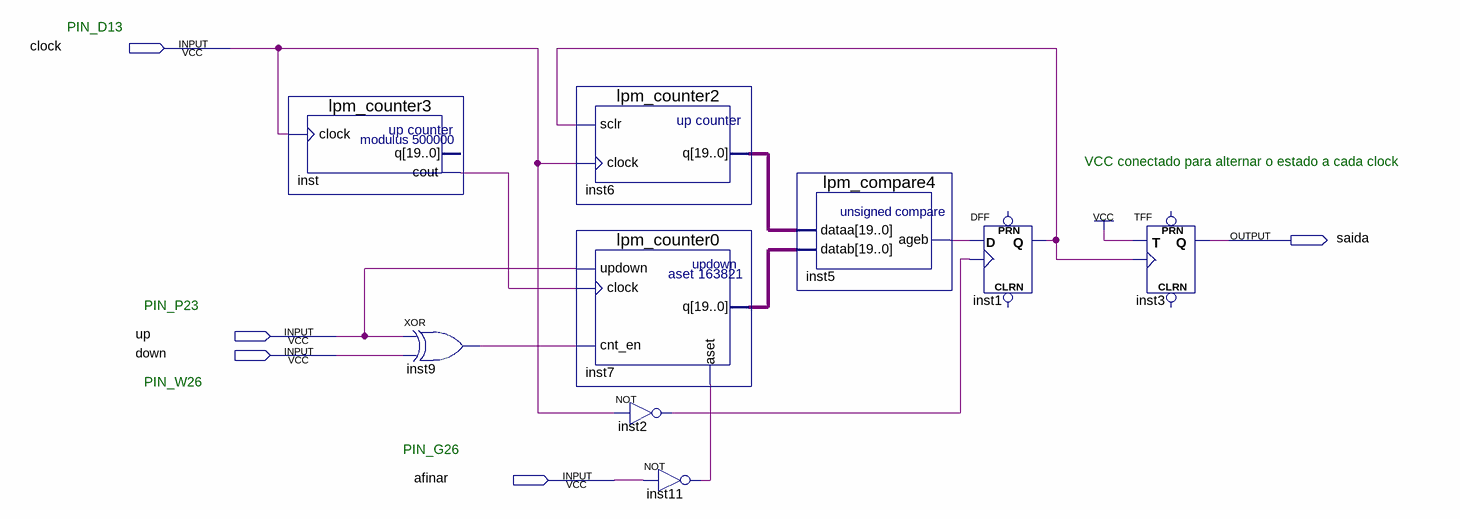
[diagram p0: schematic sheet]
// Quartus schematic oscilador.bdf as structural Verilog: 9 symbols, 5 pins
module oscilador (
  input  clock,
  input  up,
  input  down,
  input  afinar,
  output saida
);

  wire inst1_q, inst2_out, inst5_ageb, inst9_out, inst11_out, inst_cout;
  wire [19:0] inst6_q, inst7_q;

  lpm_counter3 inst (.clock(clock), .cout(inst_cout));  // open: q
  xor inst9 (inst9_out, up, down);
  lpm_counter2 inst6 (.sclr(inst1_q), .clock(clock), .q(inst6_q));
  lpm_counter0 inst7 (.updown(up), .clock(inst_cout), .cnt_en(inst9_out), .aset(inst11_out), .q(inst7_q));
  not inst2 (inst2_out, clock);
  not inst11 (inst11_out, afinar);
  lpm_compare4 inst5 (.dataa(inst6_q), .datab(inst7_q), .ageb(inst5_ageb));
  DFF inst1 (.CLK(inst2_out), .D(inst5_ageb), .Q(inst1_q));  // open: CLRN, PRN
  TFF inst3 (.T(1'b1), .CLK(inst1_q), .Q(saida));  // open: PRN, CLRN

  // Notes on the sheet:
  //   PIN_D13
  //   VCC conectado para alternar o estado a cada clock
  //   PIN_P23
  //   PIN_W26
  //   PIN_G26
endmodule
